# EAGLE design bandido (EAGLE 5.06)
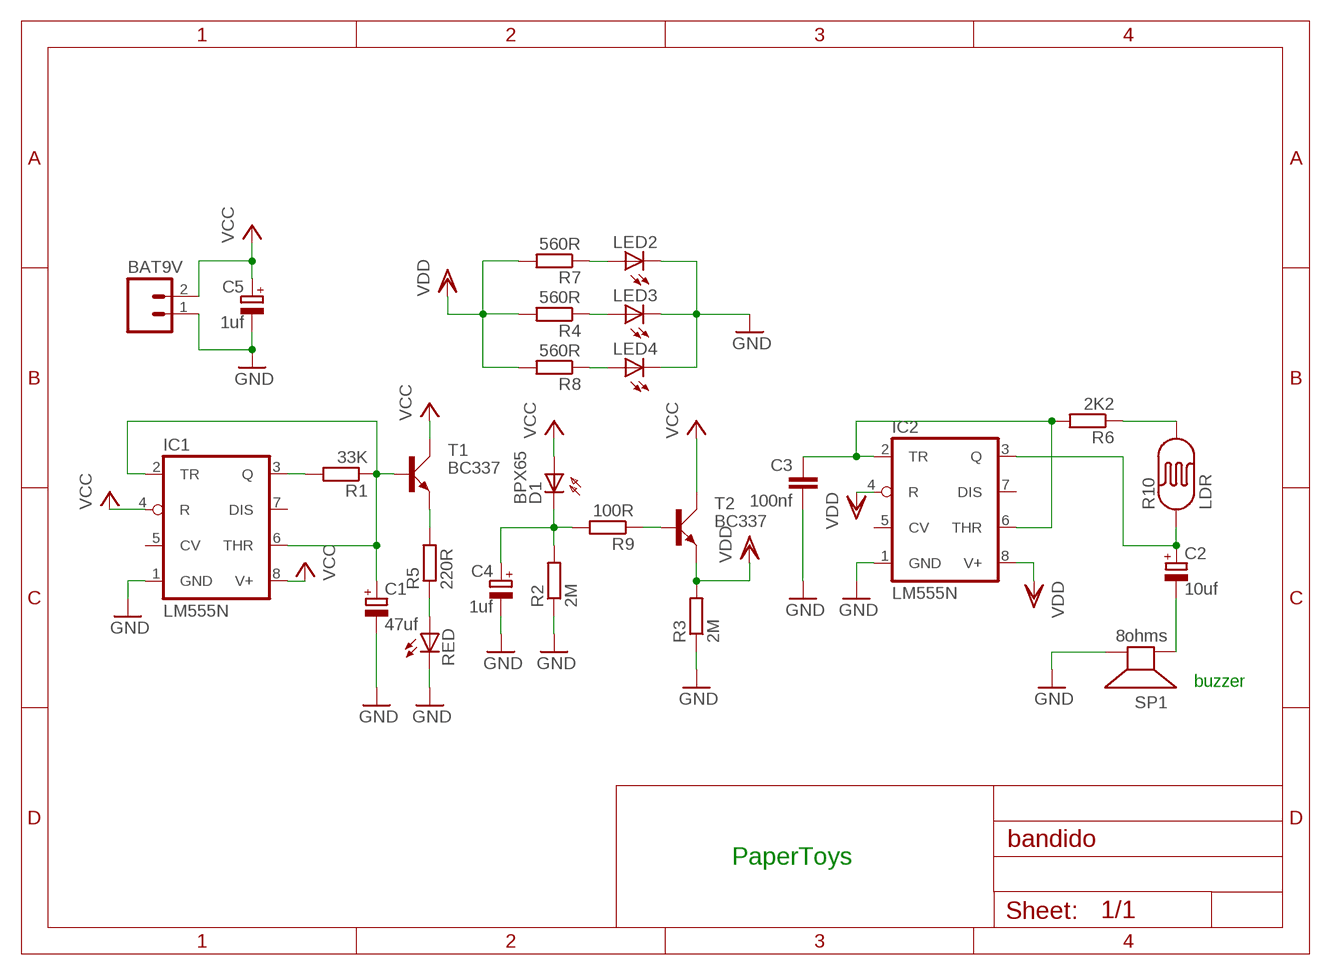
[diagram p0: schematic, sheet 1]

## Parts
BAT9V  M025MM  [SCREWTERMINAL-5MM-2]
C1  47uf  CPOL-EUE5-4  [E5-4]
C2  10uf  CPOL-EUE5-4  [E5-4]
C3  100nf  C-EU025-024X044  [C025-024X044]
C4  1uf  CPOL-EUE5-4  [E5-4]
C5  1uf  CPOL-EUE5-4  [E5-4]
D1  BPX65  [BPX65]
IC1  LM555N  [DIL08-ROUND]
IC2  LM555N  [DIL08-ROUND]
LED2  LED5MM  [LED5MM]
LED3  LED5MM  [LED5MM]
LED4  LED5MM  [LED5MM]
R1  33K  R-EU_0204/7  [0204/7]
R2  2M  R-EU_0204/7  [0204/7]
R3  2M  R-EU_0204/7  [0204/7]
R4  560R  R-EU_0204/7  [0204/7]
R5  220R  R-EU_0204/7  [0204/7]
R6  2K2  R-EU_0204/7  [0204/7]
R7  560R  R-EU_0204/7  [0204/7]
R8  560R  R-EU_0204/7  [0204/7]
R9  100R  R-EU_0204/7  [0204/7]
R10  LDR  PHOTOCELLPTH-KIT  [PHOTOCELL-KIT]
RED  LED5MM  [LED5MM]
SP1  8ohms  SPEAKER/AL11P  [AL11P]
T1  BC337  [SOT54A]
T2  BC337  [SOT54A]

## Nets
GND: BAT9V.1 C1.- C3.2 C4.- C5.- IC1.1(GND) IC2.1(GND) LED2.K(C) LED3.K(C) LED4.K(C) R2.1 R3.1 RED.K(C) SP1.-
N$1: C4.+ D1.K(C) R2.2 R9.2
N$2: R5.1 RED.A
N$3: R5.2 T1.E
N$4: C1.+ IC1.2(TR) IC1.6(THR) R1.1 T1.B
N$5: IC1.3(Q) R1.2
N$6: R9.1 T2.B
N$7: C3.1 IC2.2(TR) IC2.6(THR) R6.2
N$8: C2.- SP1.+
N$9: LED2.A R7.1
N$10: LED3.A R4.1
N$11: LED4.A R8.1
N$12: R6.1 R10.2
N$13: C2.+ IC2.3(Q) R10.1
VCC: BAT9V.2 C5.+ D1.A IC1.4(R) IC1.8(V+) T1.C T2.C
VDD: IC2.4(R) IC2.8(V+) R3.2 R4.2 R7.2 R8.2 T2.E
Unconnected: IC1.5(CV) IC1.7(DIS) IC2.5(CV) IC2.7(DIS)

## Notes on the sheet
- buzzer
- PaperToys

## Library data of the parts
BAT9V = SparkFun:M02: Header 2 Standard 2-pin 0.1" header. Use with straight break away headers (SKU : PRT-00116), right angle break away headers (PRT-00553), swiss pins (PRT-00743), machine pins (PRT-00117), and female headers (PRT-00115). Molex polarized connector foot print use with SKU : PRT-08233 with associated crimp pins and housings.
C1 C2 C4 C5 = rcl:CPOL-EU: POLARIZED CAPACITOR, European symbol
C3 = rcl:C-EU: CAPACITOR, European symbol
D1 = opto-trans-siemens:BPX65: PHOTO DIODE; MPN: BPX65.; OC_FARNELL: 327451; OC_NEWARK: 06WX2764
IC1 IC2 = adafruit:*555: TIMER Changed DIP package to have round (not oval) pin pads http://www.ladyada.net/library/pcb/eaglelibrary.html
LED2-LED4 RED = adafruit:LED: LED OSRAM: - CHIPLED LG R971, LG N971, LY N971, LG Q971, LY Q971, LO R971, LY R971 LH N974, LH R974 LS Q976, LO Q976, LY Q976 LO Q996 - Hyper CHIPLED LW Q18S LB Q993, LB Q99A, LB R99A - SideLED LS A670, LO A670, LY A670, LG A670, LP A670 LB A673, LV A673, LT A673, LW A673 LH A674 LY A675 LS A676, LA A676, LO A676, LY A676, LW A676 LS A679, LY A679, LG A679 - Hyper Micro SIDELED® LS Y876, LA Y876, LO Y876, LY Y876 LT Y87S - SmartLED LW L88C, LW L88S LB L89C, LB L89S, LG L890 LS L89K, LO L89K, LY L89K LS L896, LA L896, LO L896, LY L896 - TOPLED LS T670, LO T670, LY T670, LG T670, LP T670 LSG T670, LSP T670, LSY T670, LOP T670, LYG T670 LG T671, LOG T671, LSG T671 LB T673, LV T673, LT T673, LW T673 LH T674 LS T676, LA T676, LO T676, LY T676, LB T676, LH T676, LSB T676, LW T676 LB T67C, LV T67C, LT T67C, LS T67K, LO T67K, LY T67K, LW E67C LS E67B, LA E67B, LO E67B, LY E67B, LB E67C, LV E67C, LT E67C LW T67C LS T679, LY T679, LG T679 LS T770, LO T770, LY T770, LG T770, LP T770 LB T773, LV T773, LT T773, LW T773 LH T774 LS E675, LA E675, LY E675, LS T675 LS T776, LA T776, LO T776, LY T776, LB T776 LHGB T686 LT T68C, LB T68C - Hyper Mini TOPLED® LB M676 - Mini TOPLED Santana® LG M470 LS M47K, LO M47K, LY M47K Source: http://www.osram.convergy.de/
R1-R9 = rcl:R-EU_: RESISTOR, European symbol
R10 = SparkFun:PHOTOCELL: Photocell Also known as a CdS photoresistor. This is a low cost way to detect light levels. Resistance decreases with more incoming light. SparkFun SKU: SEN-09088
SP1 = adafruit:SPEAKER: SPEAKER Source: Buerklin Added PS12 (for part # PS1240 piezo) http://www.ladyada.net/library/pcb/eaglelibrary.html
T1 T2 = transistor-small-signal:BC337: NPN TRANSISTOR

## Board
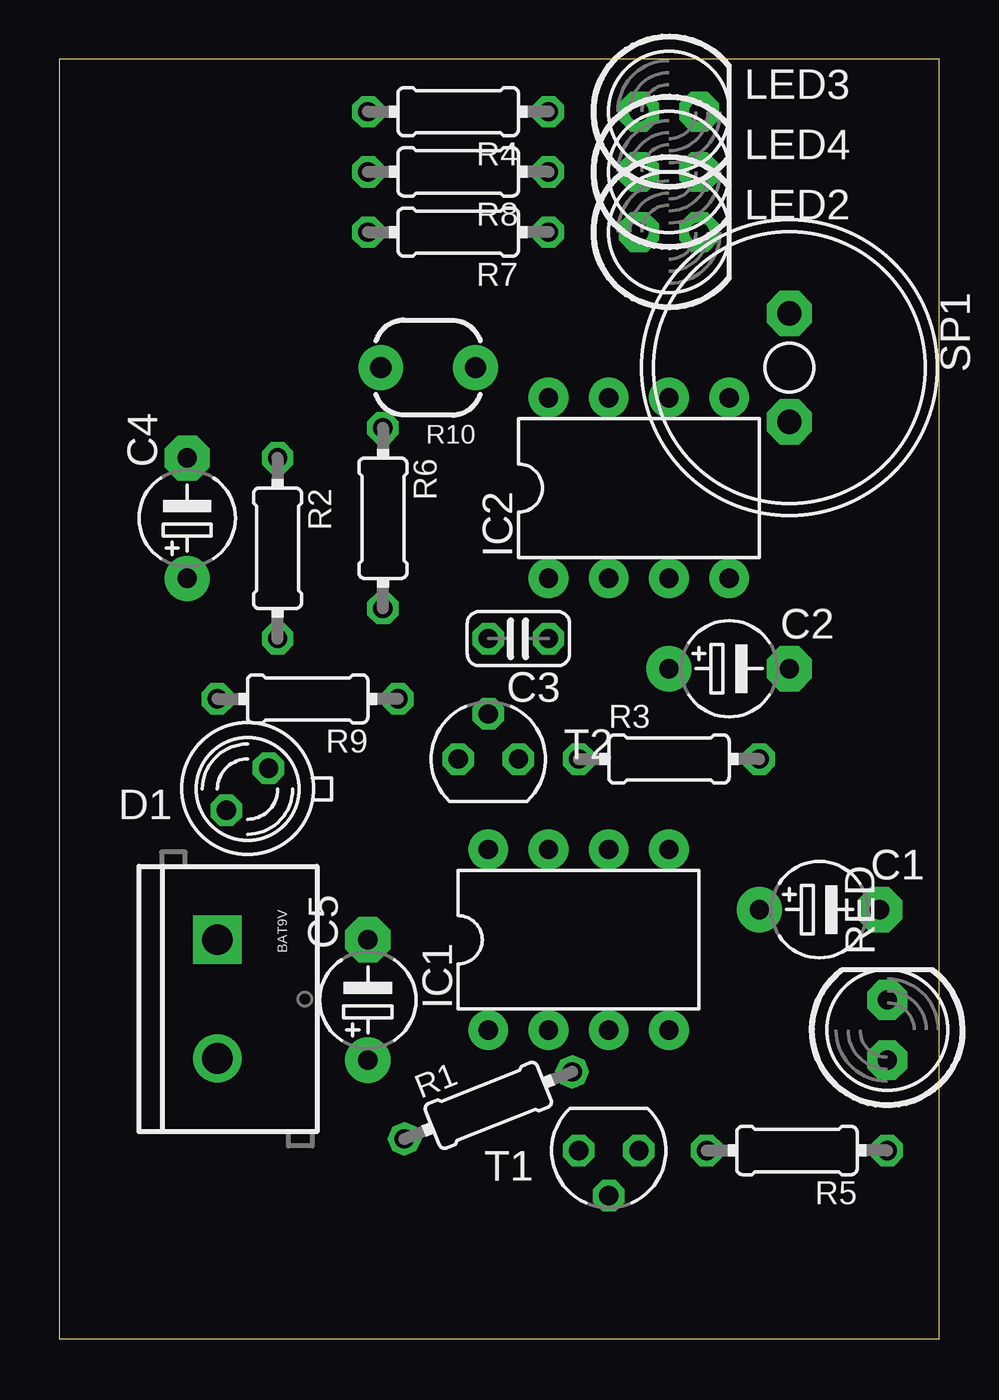
[diagram p1: board, top side]
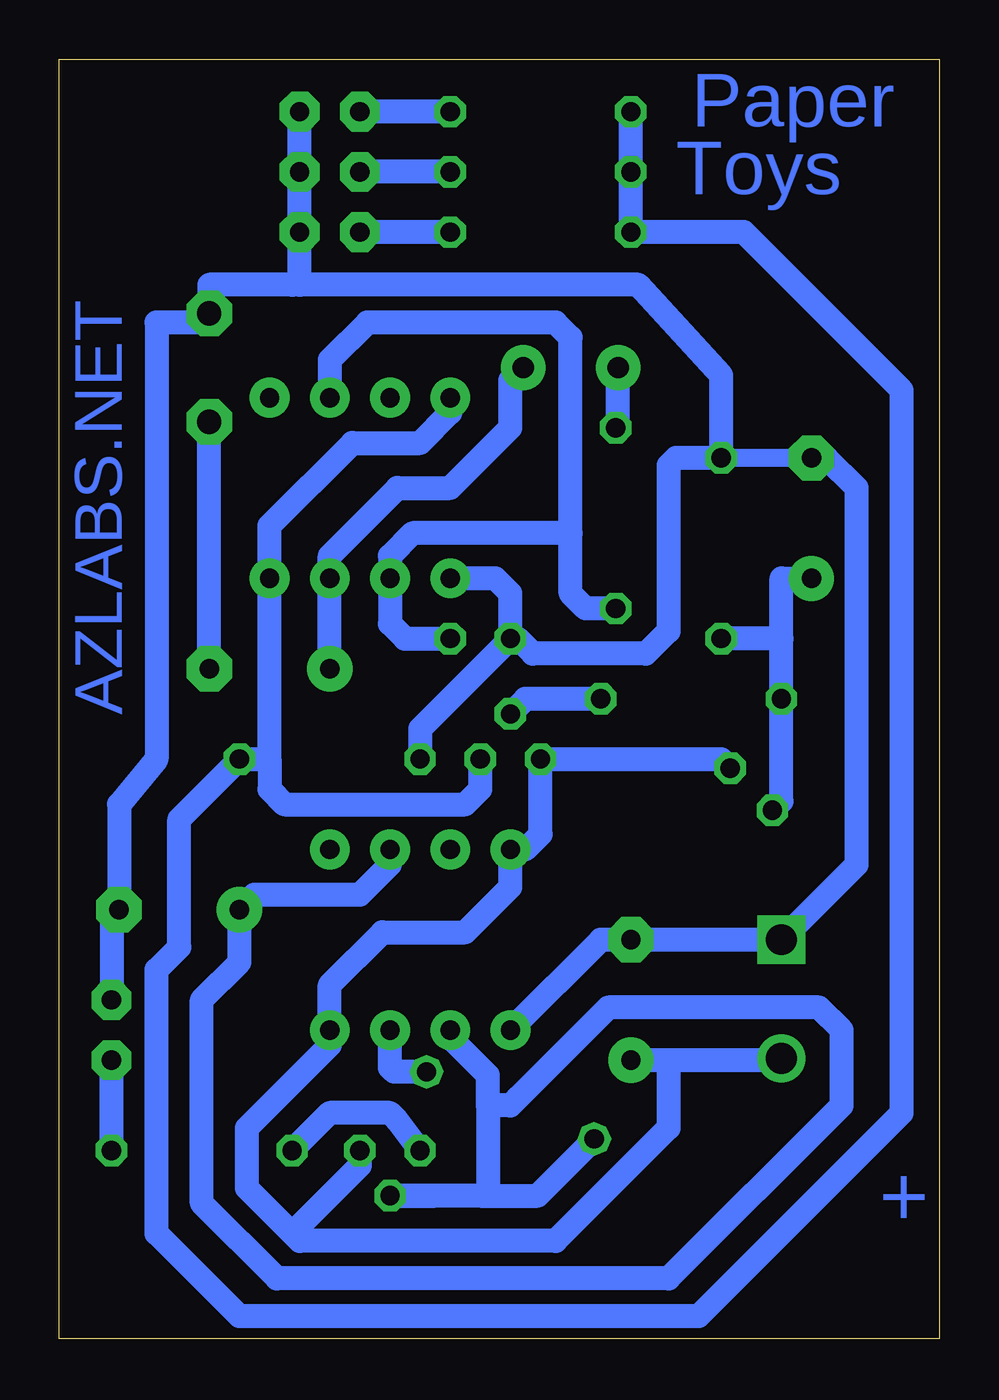
[diagram p2: board, bottom side, seen from below]

Size 37.13 x 53.96 mm. Coordinates in mm from the lower left corner, seen from the top.
Outline: 0,0 37.13,0 37.13,53.96 0,53.96 0,0
Copper layers (1*16): Top 0.035mm / dielectric 1.5mm / Bottom 0.035mm
Design rules "default *": minimum track width 30mil, minimum drill 24mil, track to track 8mil, track to pad 8mil, pad to pad 8mil, via to via 8mil, smd to smd 8mil, copper to edge 40mil, drill to drill 8mil, minimum pad ring 10mil, minimum via ring 8mil, stop-mask expansion 4mil, vias tented up to drill 0mil, thermal gap 10mil

### Footprints (pad centres in the part's own frame; a part is rotated, then mirrored left to right if it is on the bottom)
SCREWTERMINAL-5MM-2 = drill 1.3 pad 2.032 square: 1 0,0 | drill 1.3 pad 2.032 round: 2 5,0
E5-4 = drill 0.813 pad 1.905 round: + -2.54,0 | drill 0.813 pad 1.905 octagon: - 2.54,0
C025-024X044 = drill 0.813 octagon: 1 -1.27,0; 2 1.27,0
BPX65 = drill 0.813 octagon: A -0.889,-0.889; K 0.889,0.889
DIL08-ROUND = drill 0.813 pad 1.676 round: 1 -3.81,-3.81; 2 -1.27,-3.81; 3 1.27,-3.81; 4 3.81,-3.81; 5 3.81,3.81; 6 1.27,3.81; 7 -1.27,3.81; 8 -3.81,3.81
LED5MM = drill 0.813 pad 1.676 octagon: A -1.27,0; K 1.27,0
0204/7 = drill 0.813 octagon: 1 -3.81,0; 2 3.81,0
PHOTOCELL-KIT = drill 0.9 pad 1.88 round: 1 -2,0; 2 2,0
AL11P = drill 1.016 pad 1.905 octagon: + 2.286,0; - -2.286,0
SOT54A = drill 0.813 octagon: B 0,1.905; C -1.27,0; E 1.27,0

### Placement (x,y rotation side)
BAT9V  6.67,16.83 270 top
C1  32.07,18.1 0 top
C2  28.26,28.26 0 top
C3  19.37,29.53 180 top
C4  5.4,34.61 90 top
C5  13.02,14.29 90 top
D1  7.94,23.18 180 top
IC1  21.91,16.83 0 top
IC2  24.45,35.88 0 top
LED2  25.72,46.67 0 top
LED3  25.72,51.75 0 top
LED4  25.72,49.21 0 top
R1  18.1,9.84 21.8 top
R2  9.21,33.34 270 top
R3  25.72,24.45 0 top
R4  16.83,51.75 180 top
R5  31.11,7.94 180 top
R6  13.65,34.61 270 top
R7  16.83,46.67 180 top
R8  16.83,49.21 180 top
R9  10.48,26.99 180 top
R10  15.56,40.96 180 top
RED  34.92,13.02 90 top
SP1  30.8,40.96 270 top
T1  23.18,7.94 180 top
T2  18.1,24.45 0 top

### Tracks (layer width: path | path; a pad name or v marks a point on that pad's centre or on a via)
GND
  Bottom 0.762: C4.- R2.1 | 30.8,43.5 SP1.- 30.8,42.86
  Bottom 1.016: LED3.K LED4.K LED2.K 26.99,44.77 | 26.99,44.77 26.99,44.45 12.7,44.45 9.21,40.64 R2.1 11.11,37.15 11.43,36.83 11.43,29.84 12.38,28.89 17.14,28.89 17.78,29.53 C3.2 | 30.8,43.5 30.8,44.45 27.3,44.45 26.99,44.77 | 30.8,42.86 33.02,42.86 33.02,24.45 34.61,22.54 C1.- 34.92,17.78 RED.K | IC2.1 18.73,32.07 18.1,31.43 C3.2 | R3.1 21.91,25.72 C3.2 | IC1.1 14.29,16.83 C5.- BAT9V.1 3.49,20 3.49,35.88 4.76,37.15 C4.-
N$1
  Bottom 1.016: 6.67,29.53 R9.2 6.67,22.67 D1.K | 6.67,29.53 6.67,32.07 C4.+ | 6.67,29.53 R2.2
N$2
  Bottom 1.016: R5.1 RED.A
N$3
  Bottom 1.016: T1.E 22.86,9.21 23.18,9.52 25.72,9.52 R5.2
N$4
  Bottom 1.016: IC1.6 23.18,20 24.45,18.73 28.89,18.73 C1.+ | C1.+ 29.53,17.78 | 19.37,6.03 16.95,6.03 R1.1 | 19.37,6.03 T1.B 21.27,6.03 | IC1.2 20.64,12.7 19.05,11.11 19.05,9.84 | 19.05,9.84 19.05,6.35 19.37,6.03 | 19.05,9.84 18.1,9.84 17.78,10.16 13.97,13.97 5.08,13.97 4.13,13.02 4.13,9.84 11.43,2.54 27.94,2.54 31.11,5.71 31.11,14.29 29.53,15.87 C1.+
N$5
  Bottom 1.016: R1.2 23,11.26 23.18,11.43 IC1.3
N$6
  Bottom 1.016: R9.1 17.46,26.99 T2.B
N$7
  Bottom 1.016: 15.56,33.97 22.23,33.97 23.18,33.02 IC2.2 23.18,30.16 22.54,29.53 C3.1 | R6.2 14.92,30.8 15.56,31.43 15.56,33.97 | IC2.6 25.72,41.28 24.13,42.86 16.19,42.86 15.56,42.23 15.56,33.97
N$8
  Bottom 1.016: C2.- SP1.+
N$9
  Bottom 1.016: R7.1 LED2.A
N$10
  Bottom 1.016: R4.1 LED3.A
N$11
  Bottom 1.016: R8.1 LED4.A
N$12
  Bottom 1.016: R10.2 13.56,38.51 R6.1
N$13
  Bottom 0.762: R10.1 18.1,40.96
  Bottom 1.016: R10.1 18.1,40.42 18.1,38.42 20.64,35.88 22.86,35.88 25.72,33.02 IC2.3 C2.+
VCC
  Bottom 0.762: BAT9V.2 6.67,11.75 | 9.21,24.45 D1.A
  Bottom 1.016: 9.21,24.45 T2.C 16.83,21.27 17.46,20.64 IC1.8 18.1,19.05 20,17.15 23.5,17.15 25.72,14.92 IC1.4 25.72,12.38 29.21,8.89 29.21,6.35 27.3,4.45 | 11.43,11.75 11.43,8.89 16.19,4.13 26.99,4.13 27.3,4.45 | 11.43,11.75 12.38,11.75 C5.+ | 6.67,11.75 11.43,11.75 | T1.C 24.45,7.3 27.3,4.45
VDD
  Bottom 1.016: R4.2 R8.2 R7.2 8.26,46.67 1.59,40.01 1.59,9.52 10.16,0.95 29.53,0.95 33.02,4.45 33.02,15.56 32.07,16.51 32.07,21.91 R3.2 28.26,24.45 | IC2.8 20.64,39.05 21.91,37.78 24.77,37.78 28.26,34.29 IC2.4 28.26,24.45 | T2.E 19.37,23.18 20,22.54 27.62,22.54 28.26,23.18 28.26,24.45

### Text on the board
Bottom: Paper | Toys | AZLABS.NET | +